# Altium schematic sheet Safety Loops.SchDoc
size A4
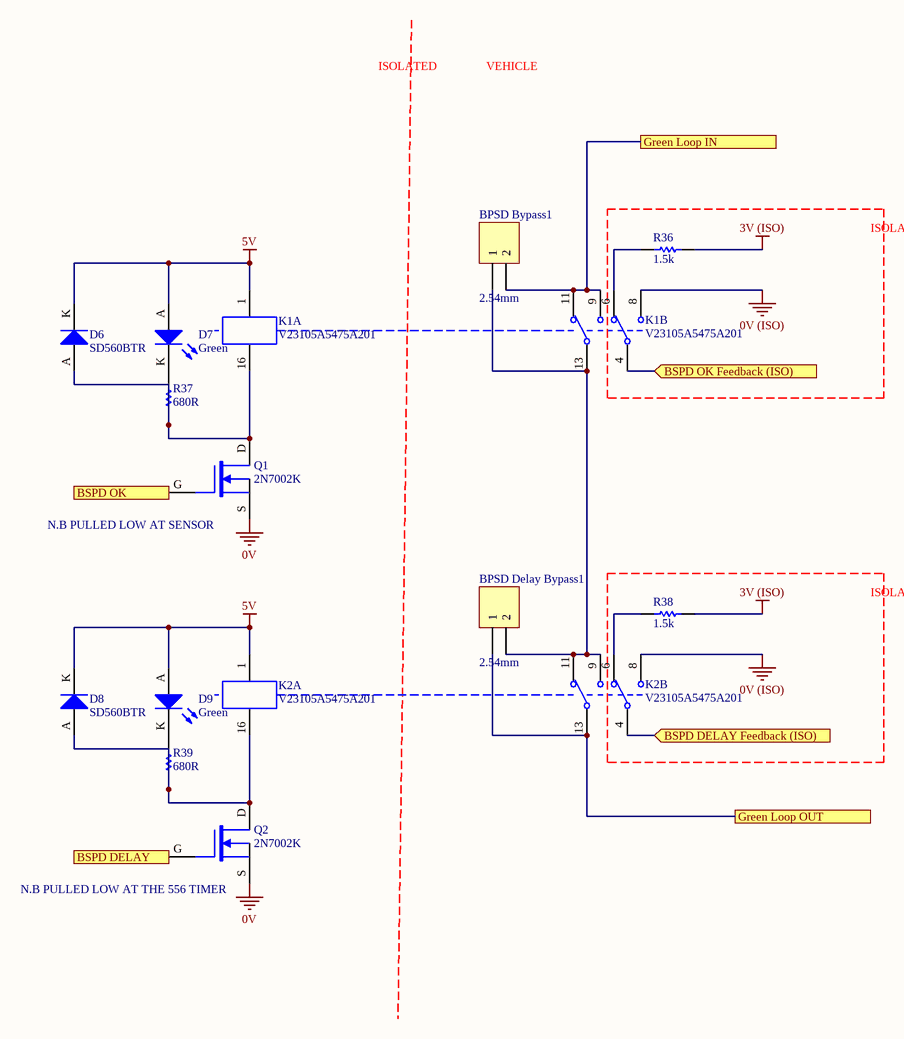
[diagram p0: Safety Loops.SchDoc]

## Parts
BPSD_Bypass1  2.54mm  [TH 2.54mm Header 1x2]
BPSD_Delay_Bypass1  2.54mm  [TH 2.54mm Header 1x2]
D6  SD560BTR  [SMB Diode]
D7  Green  [0805 LED]
D8  SD560BTR  [SMB Diode]
D9  Green  [0805 LED]
K1  V23105A5475A201  [TI 2-DIL]  (parts A,B of 2)
K2  V23105A5475A201  [TI 2-DIL]  (parts A,B of 2)
Q1  2N7002K  [SOT-343_N]
Q2  2N7002K  [SOT-343_N]
R36  1.5k  [0805]
R37  680R  [0805]
R38  1.5k  [0805]
R39  680R  [0805]

## Blocks framed on the sheet
ISOLATED: K1 R36
ISOLATED: K2 R38

## Ports
BSPD DELAY, BSPD DELAY Feedback (ISO) (in), BSPD OK, BSPD OK Feedback (ISO) (in), Green Loop IN, Green Loop OUT

## Nets
0V: Q1.S Q2.S
0V (ISO): K1.8 K2.8
3V (ISO): R36.2 R38.2
5V: D6.K D7.A D8.K D9.A K1.1 K2.1
BSPD DELAY: Q2.G ; port BSPD DELAY
BSPD DELAY Feedback (ISO): K2.4 ; port BSPD DELAY Feedback (ISO)
BSPD OK: Q1.G ; port BSPD OK
BSPD OK Feedback (ISO): K1.4 ; port BSPD OK Feedback (ISO)
Green Loop IN: BPSD_Bypass1.2 K1.9 K1.11 ; port Green Loop IN
Green Loop OUT: BPSD_Delay_Bypass1.1 K2.13 ; port Green Loop OUT
NetBPSD_Bypass1_1: BPSD_Bypass1.1 BPSD_Delay_Bypass1.2 K1.13 K2.9 K2.11
NetD6_A: D6.A K1.16 Q1.D R37.1
NetD7_K: D7.K R37.2
NetD8_A: D8.A K2.16 Q2.D R39.1
NetD9_K: D9.K R39.2
NetK1_6: K1.6 R36.1
NetK2_6: K2.6 R38.1

## Notes on the sheet
- ISOLATED
- VEHICLE
- (near Q1) N.B PULLED LOW AT SENSOR
- (near Q2) N.B PULLED LOW AT THE 556 TIMER

## Library data of the parts
BPSD_Bypass1 BPSD_Delay_Bypass1 = TH 2.54mm Header 1x2: Positions: 2; Angle: 0; Flange: No; Contact: NA; Part Number: TH 2.54mm Header 1x2; Pitch: 2.54mm; Row Spacing: 2.54mm
D6 D8 = SD560BTR: 1.2V_F 600V 5A SMB; Manufacturer: SMC Diode Solutions; Part Number: SD560BTR; Digikey Part Number: 1655-1530-2-ND; Digikey Link: https://www.digikey.com/product-detail/en/smc-diode-solutions/SD560BTR/1655-1530-2-ND/6022620
D7 D9 = SML-210FTT86: Green LED Indication - Discrete 1.75V 0805 (2012 Metric); Manufacturer: ROHM Semiconductor; Part Number: SML-210FTT86; Colour: Green; Digikey Part Number: 511-1285-1-ND; Digikey Link: https://www.digikey.com/product-detail/en/rohm-semiconductor/SML-210FTT86/511-1285-1-ND/637098
K1 K2 = V23105A5475A201: 5V DPDT Relay 3A 220VDC; Manufacturer: Axicom; Part Number: V23105A5475A201; Digikey Part Number: PB383-ND; Digikey Link: https://www.digikey.com/products/en?mpart=V23105A5001A201&v=41
Q1 Q2 = 2N7002K: 60V 380mA, NFET MOSTFET (Small Signal); Manufacturer: ON Semiconductor; Published: 24-Mar-1999; LatestRevisionDate: 29-May-2009; LatestRevisionNote: IPC-7351 Footprint Added.; PackageVersion: Sep-2000; PackageReference: SOT-343; Publisher: Altium Limited; PackageDescription: 4-Pin SOT-343 Package 1.3 mm Pitch, 2.1 mm Lead Span; Part Number: 2N7002K; Digikey Part Number: 2N7002KCT-ND; Digikey Link: https://www.digikey.com/product-detail/en/on-semiconductor/2N7002K/2N7002KCT-ND/2060375; Qty: 30
R36 R38 = RC0805FR071K5L: Manufacturer: YAGEO; Tolerance: 0.01; Rated Voltage: 0.125W; Part Number: RC0805FR071K5L; Value: 1.5k; Material: FR-07
R37 R39 = RC0805FR07680RL: Manufacturer: YAGEO; Tolerance: 0.01; Rated Voltage: 0.125W; Part Number: RC0805FR07680RL; Value: 680R; Material: FR-07